# EAGLE design MicroCo (EAGLE 8.3.2)
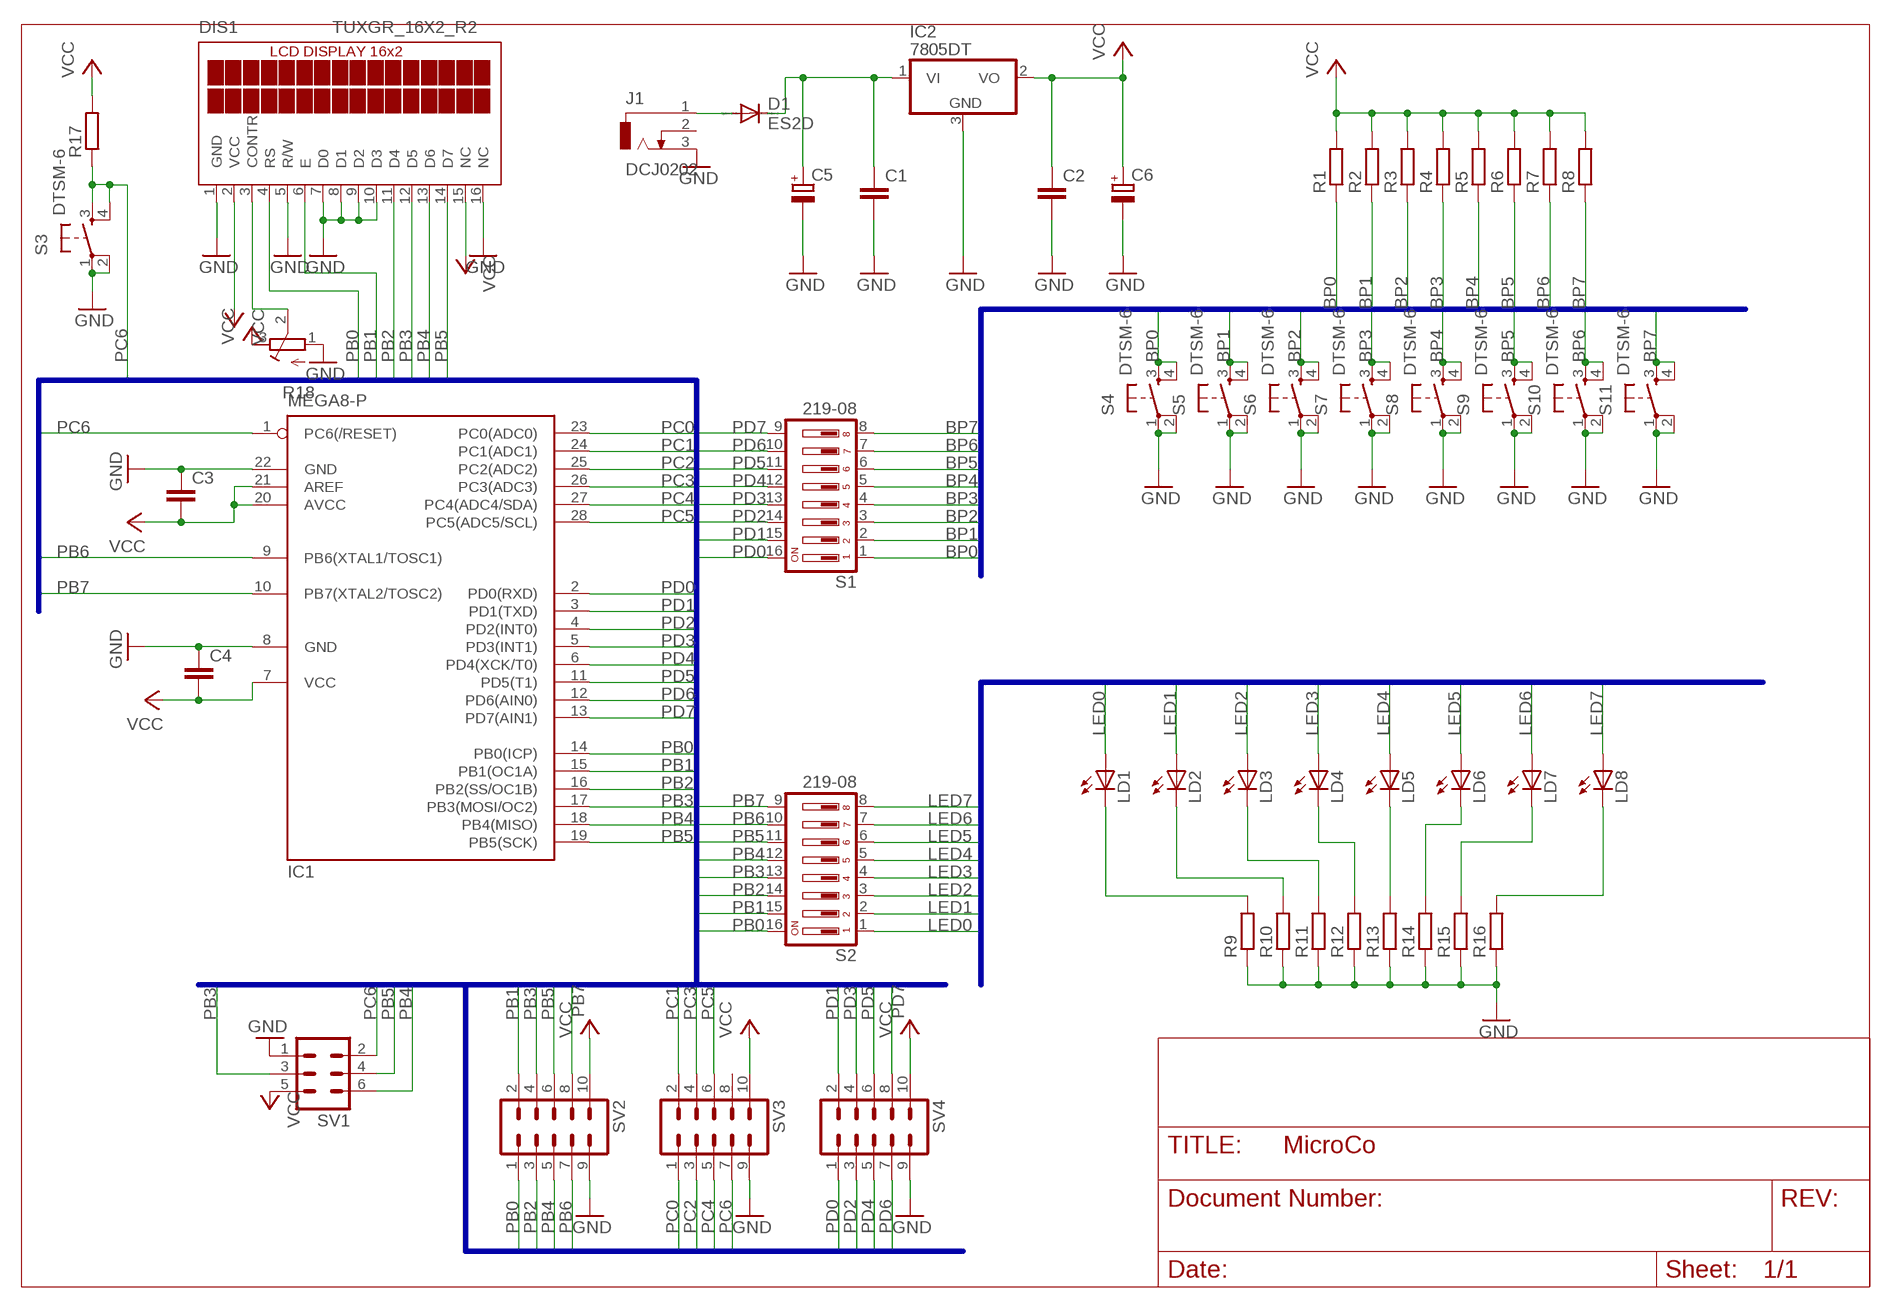
[diagram p0: schematic, sheet 1]

## Parts
C1  C-EUC1206  [C1206]
C2  C-EUC1206  [C1206]
C3  C-EUC1206  [C1206]
C4  C-EUC1206  [C1206]
C5  CPOL-EU153CLV-1010  [153CLV-1010]
C6  CPOL-EU153CLV-0605  [153CLV-0605]
D1  ES2D  [SMB]
DIS1  TUXGR_16X2_R2  [TUXGR_16X2_R2]
IC1  MEGA8-P  [DIL28-3]
IC2  7805DT  [TO252]
J1  DCJ0202  [DCJ0202]
LD1  LEDCHIPLED_1206  [CHIPLED_1206]
LD2  LEDCHIPLED_1206  [CHIPLED_1206]
LD3  LEDCHIPLED_1206  [CHIPLED_1206]
LD4  LEDCHIPLED_1206  [CHIPLED_1206]
LD5  LEDCHIPLED_1206  [CHIPLED_1206]
LD6  LEDCHIPLED_1206  [CHIPLED_1206]
LD7  LEDCHIPLED_1206  [CHIPLED_1206]
LD8  LEDCHIPLED_1206  [CHIPLED_1206]
R1  R-EU_M1206  [M1206]
R2  R-EU_M1206  [M1206]
R3  R-EU_M1206  [M1206]
R4  R-EU_M1206  [M1206]
R5  R-EU_M1206  [M1206]
R6  R-EU_M1206  [M1206]
R7  R-EU_M1206  [M1206]
R8  R-EU_M1206  [M1206]
R9  R-EU_M1206  [M1206]
R10  R-EU_M1206  [M1206]
R11  R-EU_M1206  [M1206]
R12  R-EU_M1206  [M1206]
R13  R-EU_M1206  [M1206]
R14  R-EU_M1206  [M1206]
R15  R-EU_M1206  [M1206]
R16  R-EU_M1206  [M1206]
R17  R-EU_M1206  [M1206]
R18  R-TRIMM4G/J  [RTRIM4G/J]
S1  219-08  [CTS-219-08]
S2  219-08  [CTS-219-08]
S3  DTSM-6  [DTSM-6]
S4  DTSM-6  [DTSM-6]
S5  DTSM-6  [DTSM-6]
S6  DTSM-6  [DTSM-6]
S7  DTSM-6  [DTSM-6]
S8  DTSM-6  [DTSM-6]
S9  DTSM-6  [DTSM-6]
S10  DTSM-6  [DTSM-6]
S11  DTSM-6  [DTSM-6]
SV1  ML6  [ML6]
SV2  MA05-2  [MA05-2]
SV3  MA05-2  [MA05-2]
SV4  MA05-2  [MA05-2]

## Nets
BP0: R1.1 S1.1 S4.3 S4.4
BP1: R2.1 S1.2 S5.3 S5.4
BP2: R3.1 S1.3 S6.3 S6.4
BP3: R4.1 S1.4 S7.3 S7.4
BP4: R5.1 S1.5 S8.3 S8.4
BP5: R6.1 S1.6 S9.3 S9.4
BP6: R7.1 S1.7 S10.3 S10.4
BP7: R8.1 S1.8 S11.3 S11.4
GND: C1.2 C2.2 C3.1 C4.1 C5.- C6.- DIS1.1(GND) DIS1.5(R/W) DIS1.7(D0) DIS1.8(D1) DIS1.9(D2) DIS1.10(D3) DIS1.16(NC) IC1.8(GND) IC1.22(GND) IC2.3(GND) J1.3 R9.1 R10.1 R11.1 R12.1 R13.1 R14.1 R15.1 R16.1 R18.1(A) S3.1 S3.2 S4.1 S4.2 S5.1 S5.2 S6.1 S6.2 S7.1 S7.2 S8.1 S8.2 S9.1 S9.2 S10.1 S10.2 S11.1 S11.2 SV1.1 SV2.9 SV3.9 SV4.9
LED0: LD1.A S2.1
LED1: LD2.A S2.2
LED2: LD3.A S2.3
LED3: LD4.A S2.4
LED4: LD5.A S2.5
LED5: LD6.A S2.6
LED6: LD7.A S2.7
LED7: LD8.A S2.8
N$1: DIS1.3(CONTR) R18.2(S)
N$2: D1.A J1.1
N$3: C1.1 C5.+ D1.C IC2.1(VI)
N$4: LD1.C R9.2
N$5: LD2.C R10.2
N$6: LD3.C R11.2
N$7: LD4.C R12.2
N$8: LD5.C R13.2
N$9: LD6.C R14.2
N$10: LD7.C R15.2
N$11: LD8.C R16.2
PB0: DIS1.4(RS) IC1.14(PB0(ICP)) S2.16 SV2.1
PB1: DIS1.6(E) IC1.15(PB1(OC1A)) S2.15 SV2.2
PB2: DIS1.11(D4) IC1.16(PB2(SS/OC1B)) S2.14 SV2.3
PB3: DIS1.12(D5) IC1.17(PB3(MOSI/OC2)) S2.13 SV1.3 SV2.4
PB4: DIS1.13(D6) IC1.18(PB4(MISO)) S2.12 SV1.6 SV2.5
PB5: DIS1.14(D7) IC1.19(PB5(SCK)) S2.11 SV1.4 SV2.6
PB6: IC1.9(PB6(XTAL1/TOSC1)) S2.10 SV2.7
PB7: IC1.10(PB7(XTAL2/TOSC2)) S2.9 SV2.8
PC0: IC1.23(PC0(ADC0)) SV3.1
PC1: IC1.24(PC1(ADC1)) SV3.2
PC2: IC1.25(PC2(ADC2)) SV3.3
PC3: IC1.26(PC3(ADC3)) SV3.4
PC4: IC1.27(PC4(ADC4/SDA)) SV3.5
PC5: IC1.28(PC5(ADC5/SCL)) SV3.6
PC6: IC1.1(PC6(/RESET)) R17.1 S3.3 S3.4 SV1.2 SV3.7
PD0: IC1.2(PD0(RXD)) S1.16 SV4.1
PD1: IC1.3(PD1(TXD)) S1.15 SV4.2
PD2: IC1.4(PD2(INT0)) S1.14 SV4.3
PD3: IC1.5(PD3(INT1)) S1.13 SV4.4
PD4: IC1.6(PD4(XCK/T0)) S1.12 SV4.5
PD5: IC1.11(PD5(T1)) S1.11 SV4.6
PD6: IC1.12(PD6(AIN0)) S1.10 SV4.7
PD7: IC1.13(PD7(AIN1)) S1.9 SV4.8
VCC: C2.1 C3.2 C4.2 C6.+ DIS1.2(VCC) DIS1.15(NC) IC1.7(VCC) IC1.20(AVCC) IC1.21(AREF) IC2.2(VO) R1.2 R2.2 R3.2 R4.2 R5.2 R6.2 R7.2 R8.2 R17.2 R18.3(E) SV1.5 SV2.10 SV3.10 SV4.10
Unconnected: J1.2 SV3.8

## Buses
PB[0..7],PC[0..7],PD[0..7]
BP[0..7]
LED[0..7]

## Library data of the parts
C1-C4 = rcl:C-EU: CAPACITOR, European symbol
C5 C6 = rcl:CPOL-EU: POLARIZED CAPACITOR, European symbol
D1 = diode:ES2D: DIODE super fast rectifier, 2 A
DIS1 = display-lcd:TUXGR_16X2_R2: Tuxgraphics LCD display 16x2 characters reflective, without background light Source: tuxgr_12x2_r2.pdf; OC_FARNELL: unknown; OC_NEWARK: unknown
IC1 = atmel:MEGA8-P: MICROCONTROLLER 8 Kbytes FLASH, 1 kbytes SRAM, 512 bytes EEPROM, USART, 4-channel 10 bit ADC, 2-channel 8 bit ADC Pin compatible with Atmega48, ATMega88, ATMega168 Source: avr.lbr; OC_FARNELL: unknown; OC_NEWARK: unknown
IC2 = linear:78*: Positive VOLTAGE REGULATOR Source: http://cache.national.com/ds/LM/LM78L05.pdf http://www.fairchildsemi.com/ds/LM/LM7805.pdf
J1 = con-jack:DCJ0202: DC POWER JACK Source: DCJ0202.pdf; OC_FARNELL: unknown; OC_NEWARK: unknown
LD1-LD8 = led:LED: LED OSRAM: - CHIPLED LG R971, LG N971, LY N971, LG Q971, LY Q971, LO R971, LY R971 LH N974, LH R974 LS Q976, LO Q976, LY Q976 LO Q996 - Hyper CHIPLED LW Q18S LB Q993, LB Q99A, LB R99A - SideLED LS A670, LO A670, LY A670, LG A670, LP A670 LB A673, LV A673, LT A673, LW A673 LH A674 LY A675 LS A676, LA A676, LO A676, LY A676, LW A676 LS A679, LY A679, LG A679 - Hyper Micro SIDELED® LS Y876, LA Y876, LO Y876, LY Y876 LT Y87S - SmartLED LW L88C, LW L88S LB L89C, LB L89S, LG L890 LS L89K, LO L89K, LY L89K LS L896, LA L896, LO L896, LY L896 - TOPLED LS T670, LO T670, LY T670, LG T670, LP T670 LSG T670, LSP T670, LSY T670, LOP T670, LYG T670 LG T671, LOG T671, LSG T671 LB T673, LV T673, LT T673, LW T673 LH T674 LS T676, LA T676, LO T676, LY T676, LB T676, LH T676, LSB T676, LW T676 LB T67C, LV T67C, LT T67C, LS T67K, LO T67K, LY T67K, LW E67C LS E67B, LA E67B, LO E67B, LY E67B, LB E67C, LV E67C, LT E67C LW T67C LS T679, LY T679, LG T679 LS T770, LO T770, LY T770, LG T770, LP T770 LB T773, LV T773, LT T773, LW T773 LH T774 LS E675, LA E675, LY E675, LS T675 LS T776, LA T776, LO T776, LY T776, LB T776 LHGB T686 LT T68C, LB T68C - Hyper Mini TOPLED® LB M676 - Mini TOPLED Santana® LG M470 LS M47K, LO M47K, LY M47K Source: http://www.osram.convergy.de/
R1-R17 = rcl:R-EU_: RESISTOR, European symbol
R18 = rcl:R-TRIMM: Trimm resistor
S1 S2 = switch-dil:219-08*: Surface Mount DIP Switch Series 219 SMT CTS Electronic Components Sourc: www.ctscorp.com; OC_FARNELL: unknown; OC_NEWARK: unknown
S3-S11 = switch-tact:DTSM-6
SV1 = con-ml:ML6: HARTING; OC_FARNELL: unknown; OC_NEWARK: unknown
SV2-SV4 = con-lstb:MA05-2: PIN HEADER; OC_FARNELL: unknown; OC_NEWARK: unknown

## Net classes
0 default: width 0.305 mm, drill 0.508 mm, clearance 10 mm

## Board
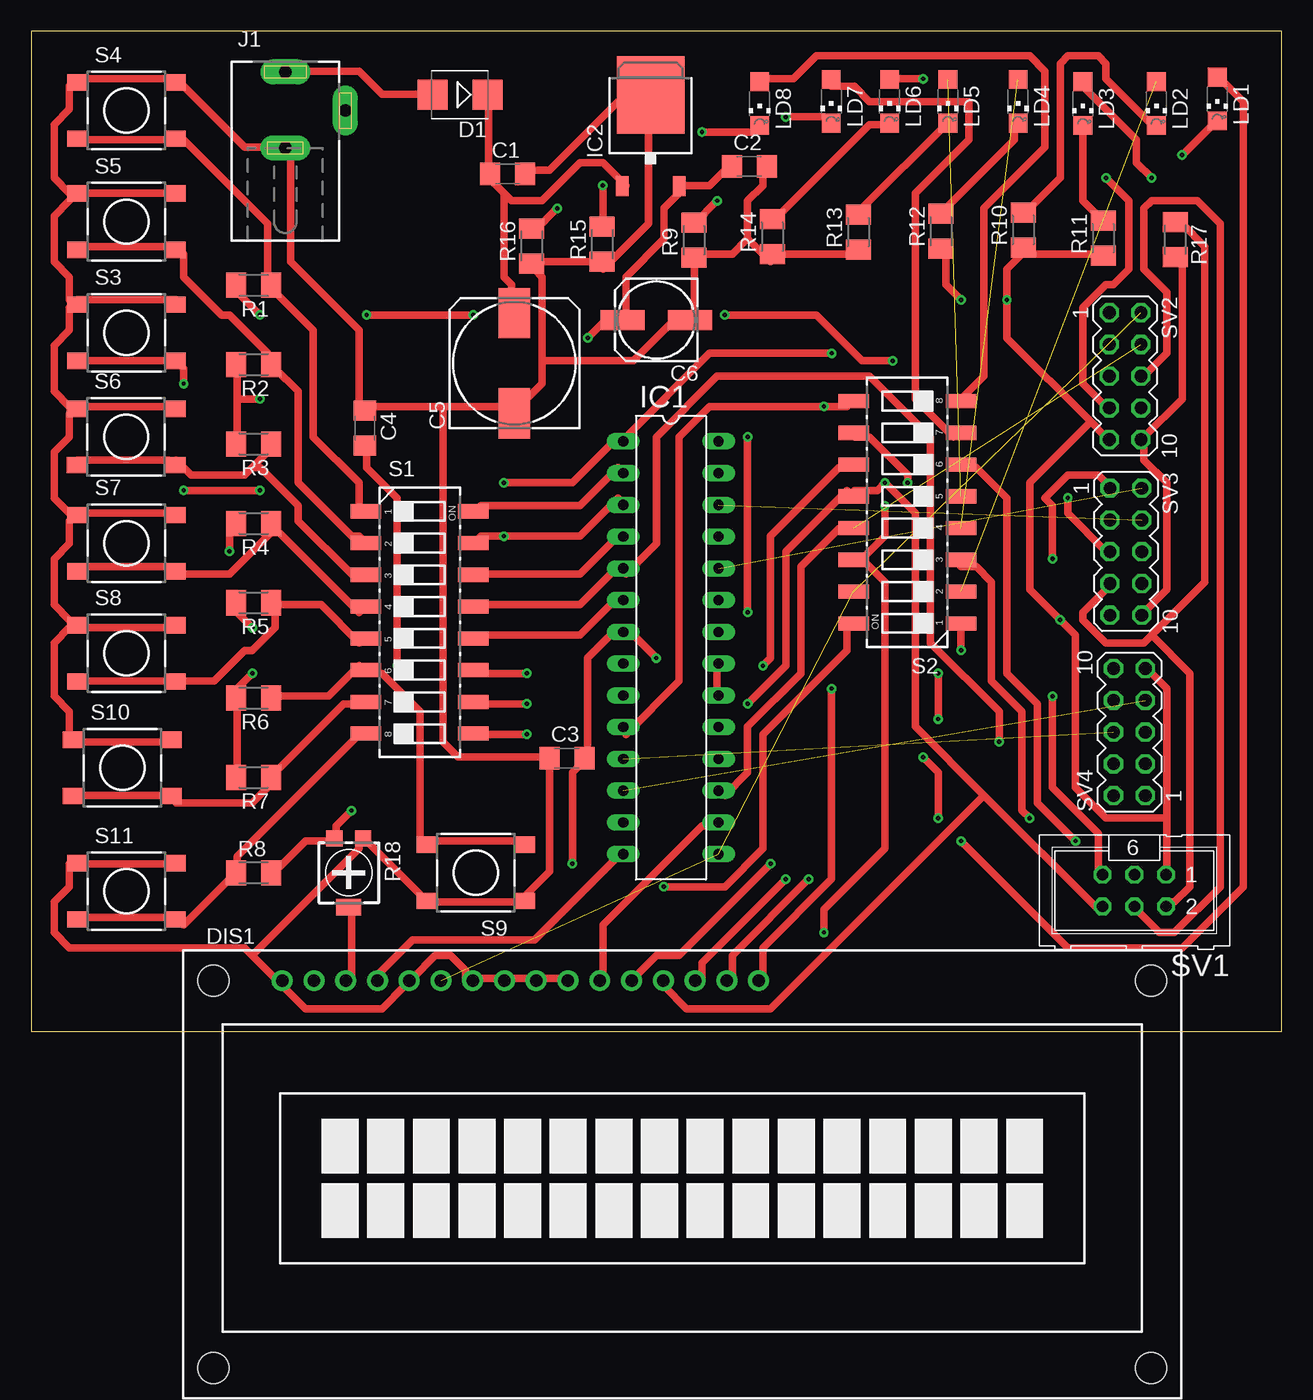
[diagram p1: board, top side]
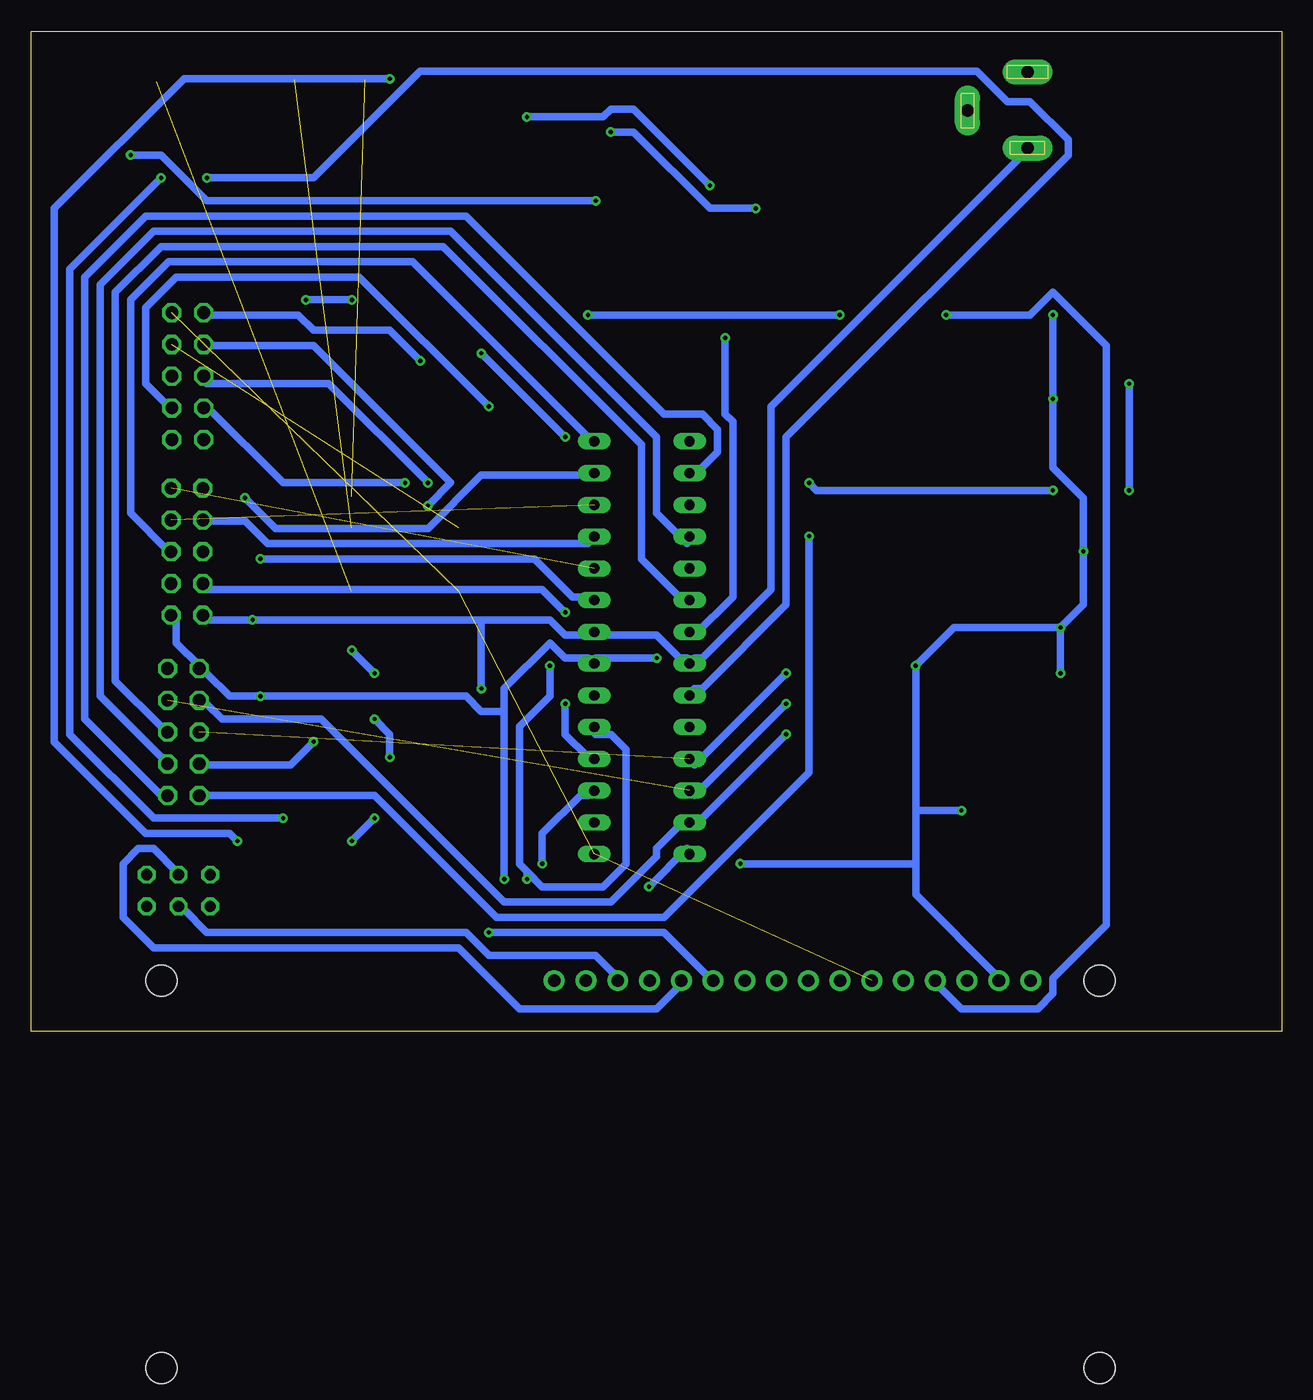
[diagram p2: board, bottom side, seen from below]

Size 100 x 80 mm. Coordinates in mm from the lower left corner, seen from the top.
Outline: 0,0 100,0 100,80 0,80 0,0
Copper layers (1*16): Top 0.035mm / dielectric 1.5mm / Bottom 0.035mm
Design rules "default *": minimum track width 24mil, minimum drill 0.35mm, track to track 24mil, track to pad 24mil, pad to pad 24mil, via to via 24mil, smd to smd 24mil, copper to edge 40mil, drill to drill 6mil, minimum pad ring 10mil, minimum via ring 8mil, stop-mask expansion 4mil, vias tented up to drill 0mil, thermal gap 10mil

### Footprints (pad centres in the part's own frame; a part is rotated, then mirrored left to right if it is on the bottom)
C1206 = smd 1.6 x 1.8: 1 -1.4,0; 2 1.4,0
153CLV-1010 = smd 4 x 2.5: + 4,0; - -4,0
153CLV-0605 = smd 3.5 x 1.6: + 2.7,0; - -2.7,0
SMB = smd 2.4 x 2.4: A 2.2,0; C -2.2,0
TUXGR_16X2_R2 = drill 1 pad 1.676: 1 -32,15.5; 2 -29.46,15.5; 3 -26.92,15.5; 4 -24.38,15.5; 5 -21.84,15.5; 6 -19.3,15.5; 7 -16.76,15.5; 8 -14.22,15.5; 9 -11.68,15.5; 10 -9.14,15.5; 11 -6.6,15.5; 12 -4.06,15.5; 13 -1.52,15.5; 14 1.02,15.5; 15 3.56,15.5; 16 6.1,15.5 | hole 2.5: -37.5,-15.5; 37.5,-15.5; -37.5,15.5; 37.5,15.5
DIL28-3 = drill 0.813 long: 1 -16.51,-3.81; 2 -13.97,-3.81; 3 -11.43,-3.81; 4 -8.89,-3.81; 5 -6.35,-3.81; 6 -3.81,-3.81; 7 -1.27,-3.81; 8 1.27,-3.81; 9 3.81,-3.81; 10 6.35,-3.81; 11 8.89,-3.81; 12 11.43,-3.81; 13 13.97,-3.81; 14 16.51,-3.81; 15 16.51,3.81; 16 13.97,3.81; 17 11.43,3.81; 18 8.89,3.81; 19 6.35,3.81; 20 3.81,3.81; 21 1.27,3.81; 22 -1.27,3.81; 23 -3.81,3.81; 24 -6.35,3.81; 25 -8.89,3.81; 26 -11.43,3.81; 27 -13.97,3.81; 28 -16.51,3.81
TO252 = smd 1 x 1.6: 1 -2.28,-4.8; 2 2.28,-4.8 | smd 5.4 x 6.2: 3 0,2.5
DCJ0202 = drill 1 pad 2 long: 1 0,3.1; 2 4.8,0; 3 0,-3
CHIPLED_1206 = smd 1.5 x 1.5: A 0,-1.75; C 0,1.75
M1206 = smd 1.6 x 2: 1 -1.4,0; 2 1.4,0
RTRIM4G/J = smd 1.3 x 1.3: 1 -1.15,-2.75; 3 1.15,-2.75 | smd 2 x 1.3: 2 0,2.75
CTS-219-08 = smd 1.13 x 2.44: 1 -8.89,-4.3; 2 -6.35,-4.3; 3 -3.81,-4.3; 4 -1.27,-4.3; 5 1.27,-4.3; 6 3.81,-4.3; 7 6.35,-4.3; 8 8.89,-4.3; 9 8.89,4.3; 10 6.35,4.3; 11 3.81,4.3; 12 1.27,4.3; 13 -1.27,4.3; 14 -3.81,4.3; 15 -6.35,4.3; 16 -8.89,4.3
DTSM-6 = smd 1.55 x 1.3: 1 -3.975,2.25; 2 3.975,2.25; 3 -3.975,-2.25; 4 3.975,-2.25
ML6 = drill 0.914 octagon: 1 -2.54,-1.27; 2 -2.54,1.27; 3 0,-1.27; 4 0,1.27; 5 2.54,-1.27; 6 2.54,1.27
MA05-2 = drill 1.016 octagon: 1 -5.08,-1.27; 2 -5.08,1.27; 3 -2.54,-1.27; 4 -2.54,1.27; 5 0,-1.27; 6 0,1.27; 7 2.54,-1.27; 8 2.54,1.27; 9 5.08,-1.27; 10 5.08,1.27

### Placement (x,y rotation side)
C1  38.1,68.58 0 top
C2  57.42,69.2 0 top
C3  42.83,21.86 0 top
C4  26.67,48.26 270 top
C5  38.64,53.44 90 top
C6  49.99,56.91 180 top
D1  34.29,74.93 180 top
DIS1  52.07,-11.43 0 top
IC1  51.16,30.69 270 top
IC2  49.53,72.39 0 top
J1  20.32,73.66 0 top
LD1  94.86,74.57 180 top
LD2  89.99,74.21 180 top
LD3  84.1,74.21 180 top
LD4  78.92,74.39 180 top
LD5  73.31,74.39 180 top
LD6  68.65,74.39 180 top
LD7  63.99,74.39 180 top
LD8  58.26,74.21 180 top
R1  17.78,59.69 180 top
R2  17.78,53.34 180 top
R3  17.78,46.99 180 top
R4  17.78,40.64 180 top
R5  17.78,34.29 180 top
R6  17.78,26.67 180 top
R7  17.78,20.32 180 top
R8  17.78,12.7 0 top
R9  53,63.28 90 top
R10  79.34,64.11 90 top
R11  85.73,63.44 90 top
R12  72.76,64.02 90 top
R13  66.15,63.93 90 top
R14  59.26,63.56 90 top
R15  45.66,62.96 90 top
R16  40.02,62.83 90 top
R17  91.5,63.32 270 top
R18  25.4,12.7 180 top
S1  31.07,32.72 270 top
S2  70.06,41.53 90 top
S3  7.62,55.88 0 top
S4  7.62,73.66 0 top
S5  7.62,64.77 0 top
S6  7.59,47.56 0 top
S7  7.62,39.06 0 top
S8  7.62,30.25 0 top
S9  35.56,12.7 180 top
S10  7.28,21.09 0 top
S11  7.62,11.22 0 top
SV1  88.23,11.28 180 top
SV2  87.49,52.42 270 top
SV3  87.55,38.37 270 top
SV4  87.83,23.95 90 top

### Tracks (layer width: path | path; a pad name or v marks a point on that pad's centre or on a via)
BP0
  Top 0.61: S4.3 3.66,71.32 11.58,71.32 S4.4 12.19,71.32 18.9,64.62 18.9,59.74 R1.1 19.51,59.13 22.55,56.08 22.55,47.55 26.21,43.89 26.21,42.06 S1.1
BP1
  Top 0.61: S5.3 3.66,62.79 11.58,62.79 S5.4 12.19,62.18 12.19,60.35 15.24,57.3 15.85,57.3 18.9,54.25 18.9,53.65 R2.1 19.51,53.03 21.34,51.21 21.34,43.89 25.6,39.62 26.21,39.62 S1.2
BP2
  Top 0.61: S6.3 3.66,45.72 10.97,45.72 S6.4 11.58,45.72 12.8,44.5 17.07,44.5 17.68,45.11 | 17.68,45.11 18.9,46.33 18.9,46.94 R3.1 | 17.68,45.11 18.29,45.11 21.34,42.06 21.34,40.84 25.6,36.58 26.21,36.58 S1.3
BP3
  Top 0.61: S7.3 3.66,37.19 11.58,37.19 S7.4 12.19,36.58 15.85,36.58 19.51,40.23 | 19.51,40.23 26.21,33.53 S1.4 | 19.51,40.23 R4.1
BP4
  Top 0.61: S8.3 3.66,28.04 11.58,28.04 S8.4 12.19,28.04 14.63,28.04 17.07,30.48 17.68,30.48 19.51,32.31 19.51,34.14 | 19.51,34.14 23.16,34.14 26.21,31.09 S1.5 | 19.51,34.14 R5.1
BP5
  Top 0.61: S9.3 39.01,15.24 31.7,15.24 S9.4 31.09,15.24 31.09,25.6 28.04,28.65 26.82,28.65 S1.6 26.21,29.26 23.77,26.82 19.51,26.82 R6.1
BP6
  Top 0.61: S10.3 3.66,18.9 10.97,18.9 S10.4 11.58,18.29 17.68,18.29 18.9,19.51 18.9,20.12 R7.1 19.51,20.73 24.99,26.21 26.21,26.21 S1.7
BP7
  Top 0.61: S11.3 3.66,9.14 11.58,9.14 S11.4 12.19,8.53 15.85,12.19 R8.1 16.46,12.8 16.46,14.02 26.21,23.77 S1.8
GND  (via drill 0.35)
  Top 0.61: 90.83,17.07 90.83,27.43 89.61,28.65 SV4.9 | 90.83,17.07 90.83,12.8 SV1.1 | v74.37,58.52 73.15,59.74 73.15,62.18 R12.1 | R11.1 85.34,62.18 79.86,62.18 R10.1 79.25,62.18 78.03,60.96 v78.03,58.52 78.03,55.47 84.73,48.77 | 84.73,48.77 85.95,47.55 SV2.9 | 90.83,17.07 85.95,17.07 83.52,19.51 83.52,31.7 v82.3,32.92 79.86,35.36 79.86,43.89 84.73,48.77 | v64.01,27.43 64.01,12.19 58.52,6.71 58.52,4.27 DIS1.16 | S3.1 3.66,58.52 11.58,58.52 S3.2 | S5.1 3.66,67.06 11.58,67.06 S5.2 | S3.1 3.05,58.52 3.05,60.35 1.83,61.57 1.83,65.23 3.05,66.45 S5.1 | S6.1 3.66,49.99 10.97,49.99 S6.2 | S7.1 3.66,41.45 11.58,41.45 S7.2 | S10.2 10.97,23.16 3.66,23.16 S10.1 3.05,23.77 3.05,25.6 1.83,26.82 1.83,31.09 3.05,32.31 S8.1 | S8.1 3.66,32.31 11.58,32.31 S8.2 | S7.1 3.05,40.84 3.05,39.01 1.83,37.8 1.83,34.14 3.05,32.92 S8.1 | S6.1 3.05,49.38 3.05,47.55 1.83,46.33 1.83,42.67 3.05,41.45 S7.1 | S3.1 3.05,57.91 3.05,56.08 1.83,54.86 1.83,51.21 3.05,49.99 S6.1 | S5.1 3.05,67.06 1.83,68.28 1.83,72.54 3.05,73.76 3.05,75.59 S4.1 3.66,76.2 11.58,76.2 S4.2 12.19,75.59 17.07,70.71 20.12,70.71 J1.3 20.73,70.1 20.73,61.57 26.21,56.08 26.21,49.99 C4.1 26.82,49.99 32.92,49.99 | DIS1.10 42.67,4.27 40.84,4.27 DIS1.9 40.23,4.27 38.41,4.27 DIS1.8 37.8,4.27 35.36,4.27 DIS1.7 34.75,4.27 34.75,4.88 33.53,6.1 32.31,6.1 30.48,4.27 DIS1.5 29.87,3.66 28.04,1.83 21.95,1.83 20.12,3.66 DIS1.1 19.51,4.27 17.68,6.1 | S11.2 11.58,13.41 3.66,13.41 S11.1 3.05,13.41 3.05,11.58 1.83,10.36 1.83,7.92 3.05,6.71 17.07,6.71 17.68,6.1 | 17.68,6.1 26.21,14.63 26.21,15.24 R18.1 26.82,15.24 31.09,10.97 S9.2 31.7,10.36 39.01,10.36 S9.1 39.62,10.97 41.45,12.8 41.45,21.34 C3.1 40.84,21.95 34.14,21.95 32.92,23.16 32.92,49.99
  Top 0.61: 57.3,63.4 57.3,66.45 58.52,67.67 58.52,68.89 C2.2 | 57.3,63.4 59.13,61.57 R14.1 59.74,62.18 65.84,62.18 R13.1 | 57.3,63.4 56.08,62.18 53.03,62.18 R9.1 53.03,61.57 53.03,57.3 C6.- 52.43,56.69 51.21,56.69 48.16,53.65 40.84,53.65 | 49.38,74.37 46.94,74.37 41.45,68.89 39.62,68.89 C1.2 | 32.92,49.99 38.41,49.99 C5.- 39.01,49.99 40.84,51.82 40.84,53.65 | 40.84,53.65 40.84,60.35 40.23,60.96 R16.1 40.23,61.57 45.11,61.57 R15.1 45.72,60.96 49.38,64.62 49.38,74.37 | 49.38,74.37 IC2.3
  Bottom 0.61: v78.03,58.52 v74.37,58.52 | 64.01,32.92 58.52,32.92 57.3,31.7 55.47,31.7 IC1.22 54.86,31.7 49.99,31.7 48.16,29.87 47.55,29.87 IC1.8 46.94,29.87 46.33,29.87 40.84,35.36 40.84,49.99 20.73,70.1 J1.3 | 64.01,32.92 v82.3,32.92 85.95,32.92 SV3.9 | 64.01,32.92 v64.01,27.43
LED0  (via drill 0.35)
  Top 0.61: v74.37,15.24 82.91,6.71 92.05,6.71 96.93,11.58 96.93,74.37 95.1,76.2 LD1.A | v72.54,17.07 72.54,20.73 v71.32,21.95 | v72.54,28.65 v72.54,24.99 | v74.37,30.48 74.37,32.31 S2.1
  Bottom 0.61: v72.54,17.07 v74.37,15.24 | v71.32,21.95 71.32,23.77 v72.54,24.99 | v74.37,30.48 v72.54,28.65
LED1  (1 unrouted)
LED2  (via drill 0.35)
  Top 0.61: v89.61,68.28 88.39,69.49 88.39,71.32 84.12,75.59 LD3.A | v79.86,17.07 79.25,17.68 79.25,25.6 76.81,28.04 76.81,35.97 75.59,37.19 74.37,37.19 S2.3
  Bottom 0.61: v89.61,68.28 96.93,60.96 96.93,23.77 90.22,17.07 v79.86,17.07
LED3  (1 unrouted)
LED4  (1 unrouted)
LED5  (via drill 0.35)
  Top 0.61: v71.32,76.2 68.89,76.2 LD6.A | v83.52,15.24 80.47,18.29 80.47,26.21 78.03,28.65 78.03,42.67 75.59,45.11 74.37,45.11 S2.6
  Bottom 0.61: v71.32,76.2 87.78,76.2 98.15,65.84 98.15,23.16 90.83,15.85 84.12,15.85 v83.52,15.24
LED6
  Top 0.61: LD7.A 64.01,75.59 65.84,75.59 67.06,74.37 74.98,74.37 74.98,71.32 70.71,67.06 70.71,50.6 73.76,47.55 S2.7
LED7
  Top 0.61: LD8.A 58.52,76.2 60.96,76.2 62.79,78.03 79.86,78.03 81.08,76.81 81.08,70.71 76.2,65.84 76.2,52.43 74.37,50.6 S2.8
N$1
  Top 0.61: R18.2 25.6,9.75 25.6,4.27 DIS1.3
N$2
  Top 0.61: D1.A 31.7,74.98 28.04,74.98 26.21,76.81 20.73,76.81 J1.1
N$3
  Top 0.61: 37.8,67.06 36.58,68.28 C1.1 36.58,68.89 36.58,74.37 D1.C | 37.8,67.06 38.41,66.45 40.84,66.45 43.89,69.49 45.72,69.49 47.55,67.67 IC2.1 | 37.8,67.06 37.8,60.35 38.41,59.74 38.41,57.91 C5.+
N$4  (via drill 0.35)
  Top 0.61: v92.05,70.1 94.49,72.54 LD1.C | v54.86,66.45 53.03,64.62 R9.2
  Bottom 0.61: v92.05,70.1 89.61,70.1 85.95,66.45 v54.86,66.45
N$5
  Top 0.61: LD2.C 89.61,72.54 85.95,76.2 85.95,77.42 85.34,78.03 82.91,78.03 82.3,77.42 82.3,68.28 79.86,65.84 R10.2
N$6
  Top 0.61: LD3.C 84.12,71.93 84.12,66.45 85.34,65.23 R11.2
N$7
  Top 0.61: LD4.C 78.64,72.54 78.64,71.32 73.15,65.84 R12.2
N$8
  Top 0.61: LD5.C 73.15,72.54 66.45,65.84 R13.2
N$9
  Top 0.61: LD6.C 68.28,72.54 67.06,72.54 59.74,65.23 R14.2
N$10  (via drill 0.35)
  Top 0.61: v60.35,73.15 63.4,73.15 LD7.C | v45.72,67.67 45.72,64.62 R15.2
  Bottom 0.61: v60.35,73.15 54.25,73.15 53.65,73.76 51.82,73.76 v45.72,67.67
N$11  (via drill 0.35)
  Top 0.61: v53.65,71.93 57.91,71.93 LD8.C | v42.06,65.84 40.23,64.01 R16.2
  Bottom 0.61: v53.65,71.93 51.82,71.93 45.72,65.84 v42.06,65.84
PB0  (via drill 0.35)
  Top 0.61: v50.6,11.58 55.47,11.58 58.52,14.63 58.52,23.77 65.23,30.48 65.23,32.31 S2.16 | v68.89,53.65 66.45,53.65 62.79,57.3 v55.47,57.3 | v26.82,57.3 v35.36,57.3 | IC1.14 46.94,14.02 40.23,7.32 30.48,7.32 27.43,4.27 DIS1.4
  Bottom 0.61: v50.6,11.58 47.55,14.63 IC1.14 | v68.89,53.65 71.32,56.08 77.42,56.08 78.64,57.3 85.95,57.3 SV2.1 | v35.36,57.3 v55.47,57.3 | v26.82,57.3 20.12,57.3 18.29,59.13 14.02,54.86 14.02,8.53 18.29,4.27 18.29,3.05 19.51,1.83 25.6,1.83 27.43,3.66 DIS1.4
PB1  (3 unrouted)
PB2  (via drill 0.35)
  Top 0.61: IC1.16 54.86,16.46 53.65,16.46 45.72,8.53 45.72,4.27 DIS1.11 | 66.45,37.8 65.84,37.8 S2.14 66.45,37.8 | 66.45,37.8 68.28,39.62 v68.28,42.06 | v63.4,7.92 63.4,9.75 68.28,14.63 68.28,35.97 66.45,37.8
  Bottom 0.61: v68.28,42.06 66.45,43.89 77.42,54.86 85.95,54.86 SV2.3 | v63.4,7.92 49.38,7.92 45.72,4.27 DIS1.11
PB3  (via drill 0.35)  (1 unrouted)
  Top 0.61: S2.13 65.23,40.23 64.62,40.23 61.57,37.19 61.57,28.65 57.3,24.38 57.3,20.73 55.47,18.9 IC1.17 | v59.13,13.41 51.82,6.1 49.99,6.1 48.16,4.27 DIS1.12
  Bottom 0.61: SV1.3 88.39,12.8 90.22,14.63 91.44,14.63 92.66,13.41 92.66,9.14 90.22,6.71 65.84,6.71 60.96,1.83 49.99,1.83 48.16,3.66 DIS1.12 | v59.13,13.41 59.13,15.85 56.08,18.9 55.47,18.9 IC1.17
PB4  (via drill 0.35)
  Top 0.61: 76.2,18.9 85.34,9.75 SV1.6 | 76.2,18.9 70.71,24.38 70.71,41.45 v68.28,43.89 67.67,43.28 65.84,43.28 S2.12 65.23,43.28 60.35,38.41 60.35,29.26 v57.3,26.21 | 76.2,18.9 59.13,1.83 52.43,1.83 50.6,3.66 DIS1.13
  Bottom 0.61: v57.3,26.21 57.3,23.77 55.47,21.95 IC1.18 | v68.28,43.89 76.2,51.82 85.95,51.82 SV2.5
PB5  (via drill 0.35)
  Top 0.61: v58.52,29.26 59.13,29.87 59.13,39.62 64.62,45.11 65.23,45.11 S2.11 | SV2.6 89,52.43 90.83,54.25 90.83,59.13 89,60.96 89,65.84 89.61,66.45 93.27,66.45 95.1,64.62 95.1,11.58 91.44,7.92 90.22,7.92 88.39,9.75 SV1.4 | v60.35,12.19 53.65,5.49 53.65,4.27 DIS1.14
  Bottom 0.61: v58.52,29.26 58.52,26.82 60.96,24.38 60.96,13.41 60.35,12.8 | 60.35,12.8 59.13,11.58 54.25,11.58 52.43,13.41 52.43,22.55 53.65,23.77 54.86,23.77 IC1.19 | SV1.4 87.78,9.75 85.95,7.92 65.23,7.92 63.4,6.1 54.86,6.1 53.03,4.27 DIS1.14 | v60.35,12.19 60.35,12.8
PB6  (via drill 0.35)
  Top 0.61: v70.1,43.89 70.1,44.5 67.06,47.55 65.84,47.55 S2.10 | v85.95,68.28 87.78,66.45 87.78,60.96 86.56,59.74 85.95,59.74 84.12,57.91 84.12,51.82 85.95,49.99 SV2.7
  Bottom 0.61: v70.1,43.89 79.86,43.89 85.95,49.99 SV2.7 | v85.95,68.28 77.42,68.28 68.89,76.81 24.38,76.81 21.95,74.37 20.12,74.37 17.07,71.32 17.07,70.1 39.62,47.55 39.62,34.14 46.33,27.43 46.94,27.43 IC1.9
PB7  (via drill 0.35)
  Top 0.61: S2.9 65.23,49.99 v63.4,49.99 54.25,49.99 51.82,47.55 51.82,28.04 47.55,23.77 IC1.10
  Bottom 0.61: v63.4,49.99 73.76,60.35 88.39,60.35 90.83,57.91 90.83,51.82 89,49.99 SV2.8
PC0  (via drill 0.35)
  Top 0.61: v81.69,37.8 81.69,42.06 81.08,42.67 82.91,44.5 85.34,44.5 85.95,43.89 SV3.1
  Bottom 0.61: v81.69,37.8 59.74,37.8 56.69,34.75 55.47,34.75 IC1.23
PC1  (1 unrouted)
PC2
  Bottom 0.61: IC1.25 55.47,39.01 81.08,39.01 82.91,40.84 85.95,40.84 SV3.3
PC3  (1 unrouted)
PC4  (via drill 0.35)
  Top 0.61: v82.91,42.67 82.91,41.45 85.95,38.41 SV3.5
  Bottom 0.61: v82.91,42.67 80.47,40.23 68.28,40.23 64.01,44.5 55.47,44.5 IC1.27
PC5
  Bottom 0.61: IC1.28 55.47,47.55 69.49,61.57 89,61.57 92.05,58.52 92.05,41.45 89,38.41 SV3.6
PC6  (via drill 0.35)
  Top 0.61: S3.3 3.66,53.65 11.58,53.65 S3.4 12.19,53.03 v12.19,51.82 | 89.61,31.7 89,31.09 85.95,31.09 84.12,32.92 84.12,33.53 85.95,35.36 SV3.7 | 89.61,31.7 93.88,35.97 93.88,62.79 92.05,64.62 R17.1 | v64.01,54.25 54.25,54.25 47.55,47.55 IC1.1 46.94,47.55 43.28,43.89 v37.8,43.89 | v57.3,33.53 v57.3,47.55 | 89.61,31.7 92.66,28.65 92.66,11.58 91.44,10.36 90.83,10.36 SV1.2 | v18.29,43.28 v12.19,43.28
  Bottom 0.61: v57.3,47.55 v64.01,54.25 | v57.3,33.53 59.13,35.36 85.95,35.36 SV3.7 | v12.19,43.28 v12.19,51.82 | v18.29,43.28 37.19,43.28 v37.8,43.89
PD0
  Top 0.61: S1.16 35.97,42.06 43.89,42.06 46.94,45.11 IC1.2
  Bottom 0.61: SV4.1 89.61,18.9 95.71,24.99 95.71,60.35 90.83,65.23 65.23,65.23 49.38,49.38 46.33,49.38 45.11,48.16 45.11,46.33 46.94,44.5 IC1.2
PD1  (via drill 0.35)
  Top 0.61: S1.15 35.97,39.62 v37.8,39.62 43.89,39.62 46.94,42.67 IC1.3
  Bottom 0.61: v37.8,39.62 37.8,20.73 49.38,9.14 62.79,9.14 72.54,18.9 85.95,18.9 SV4.2
PD2
  Top 0.61: S1.14 35.97,36.58 43.89,36.58 46.94,39.62 IC1.4
  Bottom 0.61: SV4.3 89.61,21.95 94.49,26.82 94.49,59.74 90.22,64.01 66.45,64.01 49.99,47.55 49.99,41.45 47.55,39.01 IC1.4
PD3  (via drill 0.35)
  Top 0.61: S1.13 35.97,34.14 43.89,34.14 46.94,37.19 IC1.5 47.55,36.58 49.99,39.01 49.99,47.55 54.86,52.43 67.06,52.43 71.93,47.55 71.93,31.09 77.42,25.6 v77.42,23.16
  Bottom 0.61: v77.42,23.16 79.25,21.34 85.95,21.34 SV4.4
PD4
  Top 0.61: S1.12 35.97,31.7 43.89,31.7 46.94,34.75 IC1.6
  Bottom 0.61: SV4.5 89.61,24.38 93.27,28.04 93.27,59.13 89.61,62.79 67.06,62.79 51.21,46.94 51.21,37.8 47.55,34.14 IC1.6
PD5  (via drill 0.35)  (1 unrouted)
  Top 0.61: v39.62,28.65 35.97,28.65 S1.11
  Bottom 0.61: v39.62,28.65 46.94,21.34 IC1.11
PD6  (via drill 0.35)  (1 unrouted)
  Top 0.61: v39.62,26.21 35.97,26.21 S1.10
  Bottom 0.61: v39.62,26.21 46.94,18.9 IC1.12
PD7  (via drill 0.35)
  Top 0.61: v39.62,23.77 35.97,23.77 S1.9
  Bottom 0.61: v39.62,23.77 46.94,16.46 IC1.13 47.55,17.07 49.99,14.63 49.99,14.02 53.65,10.36 62.18,10.36 76.81,24.99 84.73,24.99 85.95,26.21 SV4.8
VCC  (via drill 0.35)
  Top 0.61: R8.2 19.51,12.8 21.95,15.24 23.77,15.24 R18.3 24.38,15.85 24.38,16.46 v25.6,17.68 | 16.46,50.6 16.46,53.03 R2.2 | 16.46,50.6 16.46,47.55 R3.2 | R7.2 16.46,20.73 16.46,26.21 R6.2 16.46,26.82 16.46,27.43 v17.68,28.65 | v29.26,29.26 29.26,42.67 26.82,45.11 26.82,46.33 C4.2 | v17.68,32.31 16.46,33.53 16.46,34.14 R5.2 | v15.85,38.41 15.85,40.23 R4.2 | v18.29,57.3 16.46,59.13 R1.2 | v18.29,50.6 16.46,50.6 | R17.2 92.05,61.57 92.05,50.6 89,47.55 SV2.10 89,46.94 89,45.72 90.83,43.89 90.83,35.36 89,33.53 SV3.10 | v81.69,26.82 81.69,19.51 85.34,15.85 85.34,12.8 SV1.5 | C2.1 55.47,68.89 54.25,67.67 51.82,67.67 IC2.2 51.82,67.06 50.6,65.84 50.6,63.4 47.55,60.35 47.55,57.3 C6.+ 46.94,56.69 45.72,56.69 v44.5,55.47 | IC1.20 54.86,27.43 54.86,29.26 IC1.21 | v62.18,12.19 56.08,6.1 56.08,4.27 DIS1.15 | v49.99,29.87 48.16,31.7 47.55,31.7 IC1.7 46.94,32.31 44.5,29.87 44.5,21.95 C3.2 43.89,21.34 43.28,20.73 v43.28,13.41
  Bottom 0.61: 29.26,13.41 29.26,10.97 22.55,4.27 DIS1.2 | 29.26,13.41 29.26,17.68 | 29.26,17.68 v29.26,29.26 26.21,32.31 v17.68,32.31 | v17.68,32.31 15.85,34.14 v15.85,38.41 15.85,42.67 18.29,45.11 v18.29,50.6 v18.29,57.3 | v17.68,32.31 v17.68,28.65 | 29.26,17.68 v25.6,17.68 | SV3.10 88.39,32.92 88.39,31.09 86.56,29.26 SV4.10 85.95,28.65 84.12,26.82 v81.69,26.82 65.23,26.82 64.01,25.6 62.18,25.6 | 62.18,25.6 62.18,27.43 58.52,31.09 57.3,29.87 55.47,29.87 IC1.21 54.86,29.87 v49.99,29.87 | 62.18,25.6 v62.18,12.19 | v44.5,55.47 44.5,49.38 43.89,48.77 43.89,34.75 46.94,31.7 IC1.7 | v43.28,13.41 29.26,13.41